# Altium project HAB-Main-Flight-Computer-Card-Template.PrjPcb (part 4 of 4)

## Sheet Power-Supplies.SchDoc: Main Flight Computer Power Supplies
size A2; Revision: 1A; SheetNumber: 7; SheetTotal: 7; Organization: Brickworks; Address1: Matthew Glazer; Address2: Design Engineer
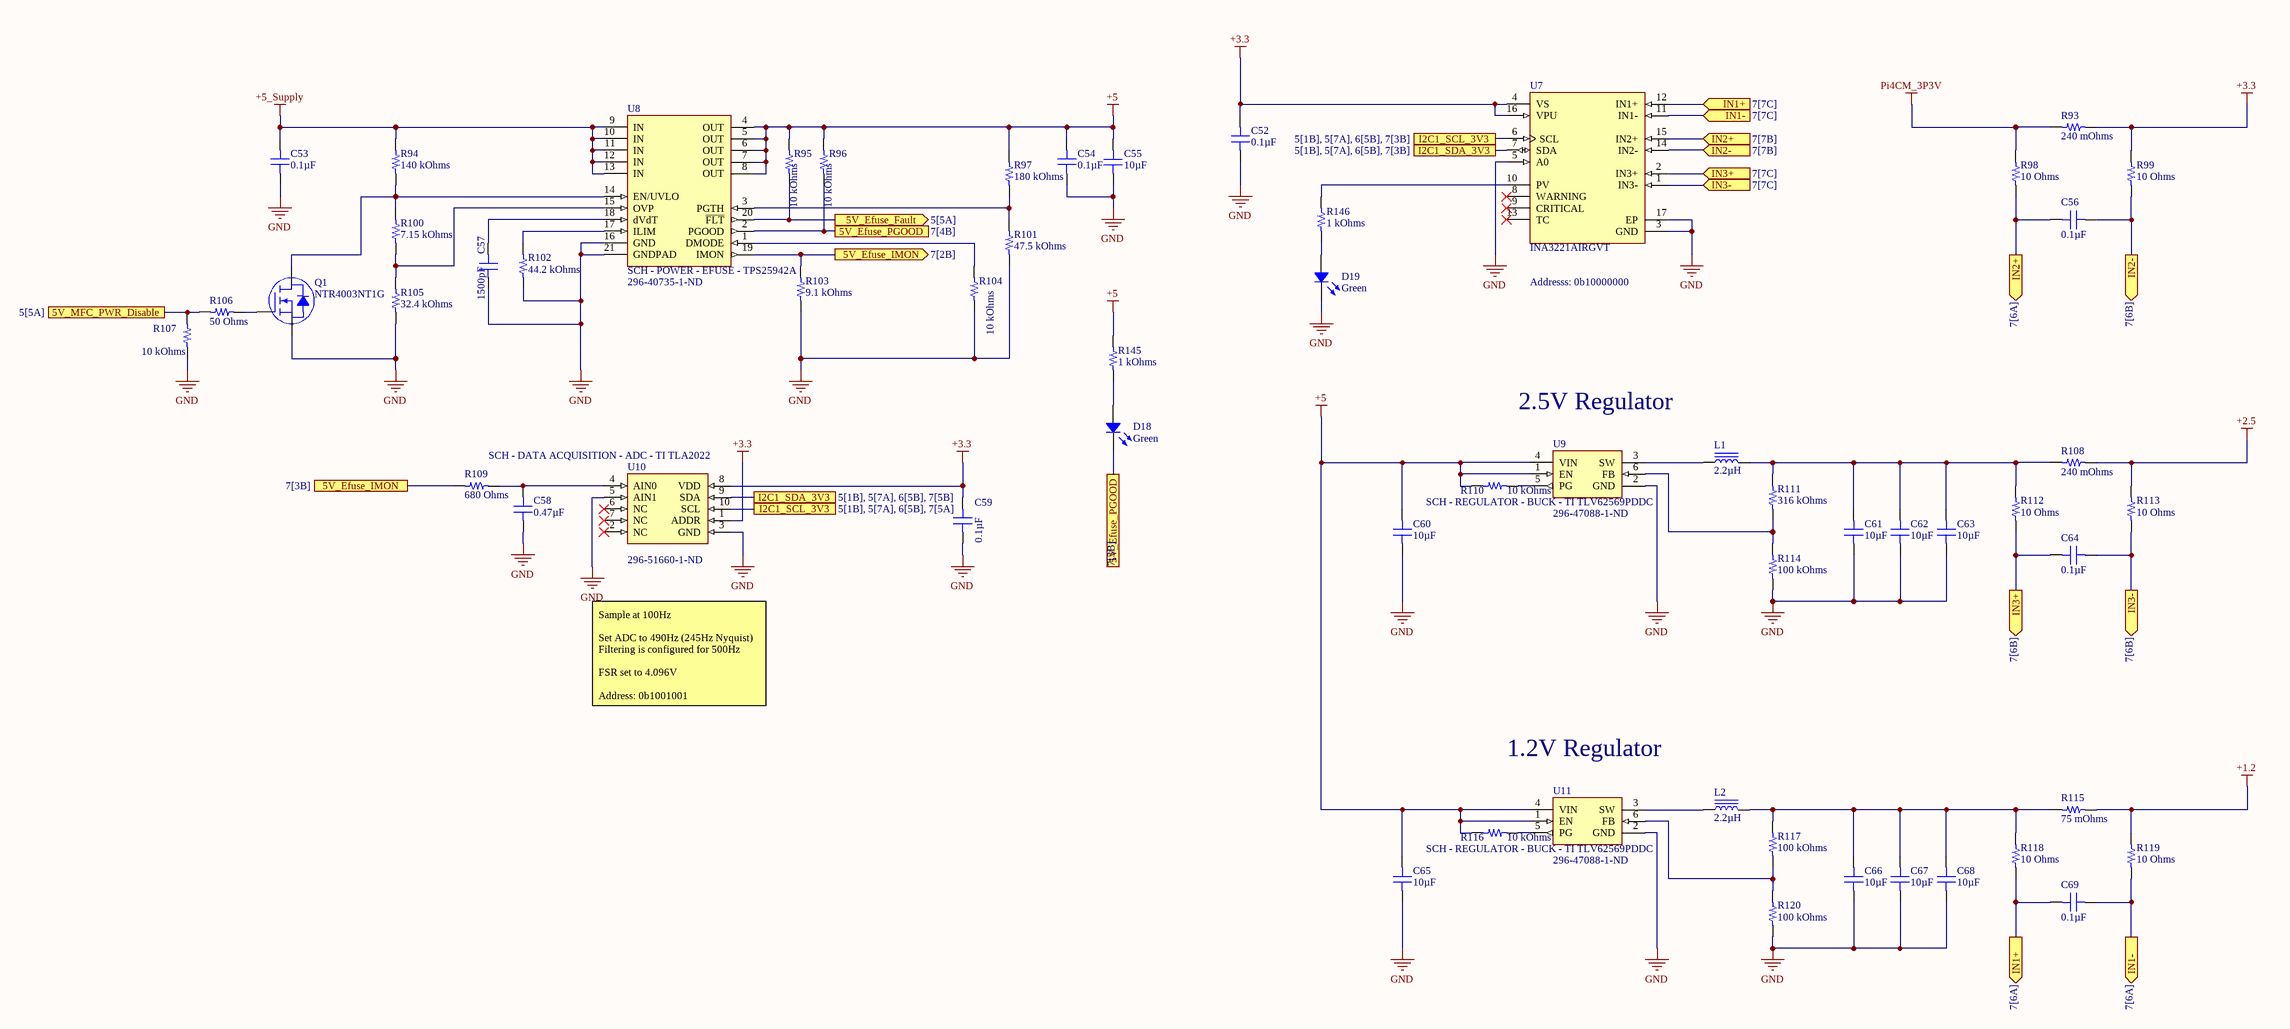
[diagram p8: Power-Supplies.SchDoc]

### Parts
C52  0.1µF  [CAP 0603_1608]
C53  0.1µF  [CAP 0603_1608]
C54  0.1µF  [CAP 0603_1608]
C55  10µF  [CAP 0805_2012]
C56  0.1µF  [CAP 0603_1608]
C57  1500pF  [CAP 0603_1608]
C58  0.47µF  [CAP 0603_1608]
C59  0.1µF  [CAP 0603_1608]
C60  10µF  [CAP 0805_2012]
C61  10µF  [CAP 0805_2012]
C62  10µF  [CAP 0805_2012]
C63  10µF  [CAP 0805_2012]
C64  0.1µF  [CAP 0603_1608]
C65  10µF  [CAP 0805_2012]
C66  10µF  [CAP 0805_2012]
C67  10µF  [CAP 0805_2012]
C68  10µF  [CAP 0805_2012]
C69  0.1µF  [CAP 0603_1608]
D18  Green  [LED 0603_1608 GREEN]
D19  Green  [LED 0603_1608 GREEN]
L1  2.2µH  [BOURNS SRN4018]
L2  2.2µH  [BOURNS SRN4018]
Q1  NTR4003NT1G  [ON SEMI SOT-23-3]
R93  240 mOhms  [RES 0805_2012]
R94  140 kOhms  [RES 0603_1608]
R95  10 kOhms  [RES 0603_1608]
R96  10 kOhms  [RES 0603_1608]
R97  180 kOhms  [RES 0603_1608]
R98  10 Ohms  [RES 0603_1608]
R99  10 Ohms  [RES 0603_1608]
R100  7.15 kOhms  [RES 0603_1608]
R101  47.5 kOhms  [RES 0603_1608]
R102  44.2 kOhms  [RES 0603_1608]
R103  9.1 kOhms  [RES 0603_1608]
R104  10 kOhms  [RES 0603_1608]
R105  32.4 kOhms  [RES 0603_1608]
R106  50 Ohms  [RES 0603_1608]
R107  10 kOhms  [RES 0603_1608]
R108  240 mOhms  [RES 0805_2012]
R109  680 Ohms  [RES 0603_1608]
R110  10 kOhms  [RES 0603_1608]
R111  316 kOhms  [RES 0603_1608]
R112  10 Ohms  [RES 0603_1608]
R113  10 Ohms  [RES 0603_1608]
R114  100 kOhms  [RES 0603_1608]
R115  75 mOhms  [RES 0805_2012]
R116  10 kOhms  [RES 0603_1608]
R117  100 kOhms  [RES 0603_1608]
R118  10 Ohms  [RES 0603_1608]
R119  10 Ohms  [RES 0603_1608]
R120  100 kOhms  [RES 0603_1608]
R145  1 kOhms  [RES 0603_1608]
R146  1 kOhms  [RES 0603_1608]
U7  INA3221AIRGVT  [RGV0016A_V]
U8  SCH - POWER - EFUSE - TPS25942A  Supplier Part Number 1: 296-40735-1-ND  [PCB - LEADLESS - QFN - TI 20-WQFN]
U9  SCH - REGULATOR - BUCK - TI TLV62569PDDC  Supplier Part Number 1: 296-47088-1-ND  [PCB - LEADS - SOT- TI TSOT-23-6]
U10  SCH - DATA ACQUISITION - ADC - TI TLA2022  Supplier Part Number 1: 296-51660-1-ND  [PCB - LEADLESS - QFN - TI X2QFN-10]
U11  SCH - REGULATOR - BUCK - TI TLV62569PDDC  Supplier Part Number 1: 296-47088-1-ND  [PCB - LEADS - SOT- TI TSOT-23-6]

### Ports
5V_Efuse_Fault (out, see 5[5A]), 5V_Efuse_IMON (out, see 7[2B]), 5V_Efuse_IMON (see 7[3B]), 5V_Efuse_PGOOD (see 7[3B]), 5V_Efuse_PGOOD (see 7[4B]), 5V_MFC_PWR_Disable (see 5[5A]), I2C1_SCL_3V3 (see 5[1B], 5[7A], 6[5B], 7[3B]), I2C1_SCL_3V3 (see 5[1B], 5[7A], 6[5B], 7[5A]), I2C1_SDA_3V3 (see 5[1B], 5[7A], 6[5B], 7[3B]), I2C1_SDA_3V3 (see 5[1B], 5[7A], 6[5B], 7[5B]), IN1+ (in, see 7[7C]), IN1+ (out, see 7[6A]), IN1- (in, see 7[7C]), IN1- (out, see 7[6A]), IN2+ (in, see 7[7B]), IN2+ (out, see 7[6A]), IN2- (in, see 7[7B]), IN2- (out, see 7[6B]), IN3+ (in, see 7[7C]), IN3+ (out, see 7[6B]), IN3- (in, see 7[7C]), IN3- (out, see 7[6B])

### Nets
+1.2: R115.2 R119.2
+2.5: R108.2 R113.2
+3.3: C52.2 C59.2 R93.2 R99.2 U7.4(VS) U7.16(VPU) U10.1(ADDR) U10.8(VDD)
+5: C54.2 C55.2 C60.2 C65.2 R95.2 R96.2 R97.2 R110.2 R116.2 R145.1 U8.4(OUT) U8.5(OUT) U8.6(OUT) U8.7(OUT) U8.8(OUT) U9.1(EN) U9.4(VIN) U11.1(EN) U11.4(VIN)
+5_Supply: C53.2 R94.2 U8.9(IN) U8.10(IN) U8.11(IN) U8.12(IN) U8.13(IN)
GND: C52.1 C53.1 C54.1 C55.1 C57.1 C58.1 C59.1 C60.1 C61.1 C62.1 C63.1 C65.1 C66.1 C67.1 C68.1 D19.2 Q1.2(S) R101.1 R102.1 R103.1 R104.1 R105.1 R107.1 R114.1 R120.1 U7.3(GND) U7.5(A0) U7.17(EP) U8.16(GND) U8.21(GNDPAD) U9.2(GND) U10.3(GND) U10.5(AIN1) U11.2(GND)
Pi4CM_3P3V: R93.1 R98.2
NetC56_1: C56.1 R99.1 U7.14(IN2-) ; port IN2-
NetC56_2: C56.2 R98.1 U7.15(IN2+) ; port IN2+
NetC57_2: C57.2 U8.18(dVdT)
NetC58_2: C58.2 R109.2 U10.4(AIN0)
NetC61_2: C61.2 C62.2 C63.2 L1.2 R108.1 R111.2 R112.2
NetC64_1: C64.1 R113.1 U7.1(IN3-) ; port IN3-
NetC64_2: C64.2 R112.1 U7.2(IN3+) ; port IN3+
NetC66_2: C66.2 C67.2 C68.2 L2.2 R115.1 R117.2 R118.2
NetC69_1: C69.1 R119.1 U7.11(IN1-) ; port IN1-
NetC69_2: C69.2 R118.1 U7.12(IN1+) ; port IN1+
NetD18_1: D18.1 R145.2
NetD18_2: D18.2 R96.1 U8.2(PGOOD) ; port 5V_Efuse_PGOOD
NetD19_1: D19.1 R146.1
NetL1_1: L1.1 U9.3(SW)
NetL2_1: L2.1 U11.3(SW)
NetQ1_1: Q1.1(G) R106.1
NetQ1_3: Q1.3(D) R94.1 R100.2 U8.14(EN/UVLO)
NetR95_1: R95.1 U8.20(~{FLT}) ; port 5V_Efuse_Fault
NetR97_1: R97.1 R101.2 U8.3(PGTH)
NetR100_1: R100.1 R105.2 U8.15(OVP)
NetR102_2: R102.2 U8.17(ILIM)
NetR103_2: R103.2 R109.1 U8.19(IMON) ; port 5V_Efuse_IMON
NetR104_2: R104.2 U8.1(DMODE)
NetR106_2: R106.2 R107.2 ; port 5V_MFC_PWR_Disable
NetR110_1: R110.1 U9.5(PG)
NetR111_1: R111.1 R114.2 U9.6(FB)
NetR116_1: R116.1 U11.5(PG)
NetR117_1: R117.1 R120.2 U11.6(FB)
NetR121_1: U7.7(SDA) U10.9(SDA) ; port I2C1_SDA_3V3
NetR122_1: U7.6(SCL) U10.10(SCL) ; port I2C1_SCL_3V3
NetR146_2: R146.2 U7.10(PV)

Not connected (* = marked no-connect by the designer): U7 8(WARNING)* 9(CRITICAL)* 13(TC)*; U10 2(NC)* 6(NC)* 7(NC)*

### Notes on the sheet
- Addresss: 0b10000000
- 2.5V Regulator
- Sample at 100Hz
  Set ADC to 490Hz (245Hz Nyquist)
  Filtering is configured for 500Hz
  FSR set to 4.096V
  Address: 0b1001001
- 1.2V Regulator
- Title
- Size:
- Date:
- File:
- A2
- Number:
- Time:
- Revision:
- Sheet
- of

### Library data of the parts
C52-C54 C56 C59 C64 C69 = CL10B104KA8WPNC: CAP CER 0.1UF 25V X7R 0603; Manufacturer: Samsung Electro-Mechanics; Tolerance: ±10%; Part Number: CL10B104KA8WPNC; Value: 0.1µF; Applications: Automotive; Capacitance: 0.1µF; ComponentLink1Description: Datasheet; ComponentLink1URL: http://www.samsungsem.com/kr/support/product-search/mlcc/CL10B104KA8WPNC.jsp; ComponentLink2Description: DigiKey Link; ComponentLink2URL: http://digikey.com/product-detail/en/samsung-electro-mechanics/CL10B104KA8WPNC/1276-6717-1-ND/5961576; Device Package: 0603 (1608 Metric); Features: Open Mode; LastUpdated: 9/2/2020 1:03:30 AM; Lifecycle Status: Active; Minimum Order: 1; Mounting Type: Surface Mount, MLCC; Operating Temperature: -55°C ~ 125°C; Package / Case: 0603 (1608 Metric); Packaging: TapeAndReel; PartId: 5631; Part Status: Active; Price: 0.02; Ratings: AEC-Q200; Series: CL; Size / Dimension: 0.063" L x 0.031" W (1.60mm x 0.80mm); Supplier 1: DigiKey; Supplier Part Number 1: 1276-6717-1-ND; Temperature Coefficient: X7R; Thickness (Max): 0.035" (0.90mm); Voltage - Rated: 25V
C55 C60-C63 C65-C68 = CC0805KKX5R7BB106: CAP CER 10UF 16V X5R 0805; Manufacturer: Yageo; Tolerance: ±10%; Part Number: CC0805KKX5R7BB106; Value: 10µF; Applications: General Purpose; Capacitance: 10µF; ComponentLink1Description: Datasheet; ComponentLink1URL: https://www.yageo.com/upload/media/product/productsearch/datasheet/mlcc/UPY-GPHC_X5R_4V-to-50V_25.pdf; ComponentLink2Description: DigiKey Link; ComponentLink2URL: http://digikey.com/product-detail/en/yageo/CC0805KKX5R7BB106/311-1865-1-ND/5195767; Device Package: 0805 (2012 Metric); LastUpdated: 9/2/2020 1:04:30 AM; Lifecycle Status: Active; Minimum Order: 1; Mounting Type: Surface Mount, MLCC; Operating Temperature: -55°C ~ 85°C; Package / Case: 0805 (2012 Metric); Packaging: TapeAndReel; PartId: 8867; Part Status: Active; Price: 0.09; Series: CC; Size / Dimension: 0.079" L x 0.049" W (2.00mm x 1.25mm); Supplier 1: DigiKey; Supplier Part Number 1: 311-1865-1-ND; Temperature Coefficient: X5R; Thickness (Max): 0.057" (1.45mm); Voltage - Rated: 16V
C57 = CC0603JRX7R8BB152: CAP CER 1500PF 25V X7R 0603; Manufacturer: Yageo; Tolerance: ±5%; Part Number: CC0603JRX7R8BB152; Value: 1500pF; Applications: General Purpose; Capacitance: 1500pF; ComponentLink1Description: Datasheet; ComponentLink1URL: https://www.yageo.com/upload/media/product/productsearch/datasheet/mlcc/UPY-GPHC_X7R_6.3V-to-50V_18.pdf; ComponentLink2Description: DigiKey Link; ComponentLink2URL: http://digikey.com/product-detail/en/yageo/CC0603JRX7R8BB152/311-3996-1-ND/8025085; Device Package: 0603 (1608 Metric); LastUpdated: 9/2/2020 1:03:18 AM; Lifecycle Status: Active; Minimum Order: 1; Mounting Type: Surface Mount, MLCC; Operating Temperature: -55°C ~ 125°C; Package / Case: 0603 (1608 Metric); Packaging: TapeAndReel; PartId: 12307; Part Status: Active; Price: 0.02; Series: CC; Size / Dimension: 0.063" L x 0.031" W (1.60mm x 0.80mm); Supplier 1: DigiKey; Supplier Part Number 1: 311-3996-1-ND; Temperature Coefficient: X7R; Thickness (Max): 0.035" (0.90mm); Voltage - Rated: 25V
C58 = C0603C474K4PACTU: CAP CER 0.47UF 16V X5R 0603; Manufacturer: KEMET; Tolerance: ±10%; Part Number: C0603C474K4PACTU; Value: 0.47µF; Applications: General Purpose; Capacitance: 0.47µF; ComponentLink1Description: Datasheet; ComponentLink1URL: https://api.kemet.com/component-edge/download/datasheet/C0603C474K4PACTU.pdf; ComponentLink2Description: DigiKey Link; ComponentLink2URL: http://digikey.com/product-detail/en/kemet/C0603C474K4PACTU/399-7934-1-ND/3471657; Device Package: 0603 (1608 Metric); LastUpdated: 9/2/2020 1:03:36 AM; Lifecycle Status: Active; Minimum Order: 1; Mounting Type: Surface Mount, MLCC; Operating Temperature: -55°C ~ 85°C; Package / Case: 0603 (1608 Metric); Packaging: TapeAndReel; PartId: 2292; Part Status: Active; Price: 0.02; Series: SMD Comm X5R; Size / Dimension: 0.063" L x 0.031" W (1.60mm x 0.80mm); Supplier 1: DigiKey; Supplier Part Number 1: 399-7934-1-ND; Temperature Coefficient: X5R; Thickness (Max): 0.034" (0.87mm); Voltage - Rated: 16V
D18 D19 = LTST-C193KGKT-5A: LED GREEN CLEAR CHIP SMD; Manufacturer: Lite-On Inc.; Configuration: Standard; Current - Test: 5mA; Lens Color: Colorless; Lens Size: 1.15mm x 0.80mm; Lens Style: Rectangle with Flat Top; Millicandela Rating: 16.25mcd; Viewing Angle: 130°; Voltage - Forward (Vf) (Typ): 2V; Wavelength - Dominant: 572nm; Wavelength - Peak: 574nm; Part Number: LTST-C193KGKT-5A; Color: Green; ComponentLink1Description: Datasheet; ComponentLink1URL: http://optoelectronics.liteon.com/upload/download/DS22-2007-0094/LTST-C193KGKT-5A.PDF; ComponentLink2Description: DigiKey Link; ComponentLink2URL: http://digikey.com/product-detail/en/lite-on-inc/LTST-C193KGKT-5A/160-1828-1-ND/2356247; Device Package: 0603 (1608 Metric); Height (Max): 0.45mm; LastUpdated: 9/2/2020 1:20:41 AM; Lens Transparency: Clear; Lifecycle Status: Active; Minimum Order: 1; Mounting Type: Surface Mount; Package / Case: 0603 (1608 Metric); Packaging: TapeAndReel; PartId: 694; Part Status: Active; Price: 0.06; Series: -; Size / Dimension: 1.60mm L x 0.80mm W; Supplier 1: DigiKey; Supplier Part Number 1: 160-1828-1-ND; Supplier Device Package: Chip LED; Value: Green
L1 L2 = SRN4018-2R2M: FIXED IND 2.2UH 2.9A 44 MOHM SMD; Manufacturer: Bourns Inc.; Current - Saturation: 3A; DC Resistance (DCR): 44mOhm Max; Frequency - Self Resonant: 60MHz; Inductance Frequency - Test: 100kHz; Material - Core: Ferrite; Q @ Freq: 9 @ 7.96MHz; Shielding: Semi-Shielded; Tolerance: ±20%; Type: Wirewound; Part Number: SRN4018-2R2M; ComponentLink1Description: Datasheet; ComponentLink1URL: https://www.bourns.com/docs/Product-Datasheets/SRN4018.pdf; ComponentLink2Description: DigiKey Link; ComponentLink2URL: http://digikey.com/product-detail/en/bourns-inc/SRN4018-2R2M/SRN4018-2R2MCT-ND/3821517; Current Rating (Amps): 2.9A; Device Package: Nonstandard; Height - Seated (Max): 0.071" (1.80mm); Inductance: 2.2µH; LastUpdated: 9/2/2020 1:30:23 AM; Lifecycle Status: Active; Minimum Order: 1; Mounting Type: Surface Mount; Operating Temperature: -40°C ~ 125°C; Package / Case: Nonstandard; Packaging: TapeAndReel; PartId: 3660; Part Status: Active; Price: 0.16; Series: SRN4018; Size / Dimension: 0.157" L x 0.157" W (4.00mm x 4.00mm); Supplier 1: DigiKey; Supplier Part Number 1: SRN4018-2R2MCT-ND; Value: 2.2µH
Q1 = NTR4003NT1G: MOSFET N-CH 30V 500MA SOT-23; Manufacturer: ON Semiconductor; Current - Continuous Drain (Id) @ 25°C: 500mA (Ta); Drive Voltage (Max Rds On,  Min Rds On): 2.5V, 4V; FET Type: N-Channel; Gate Charge (Qg) (Max) @ Vgs: 1.15nC @ 5V; Input Capacitance (Ciss) (Max) @ Vds: 21pF @ 5V; Power Dissipation (Max): 690mW (Ta); Rds On (Max) @ Id, Vgs: 1.5Ohm @ 10mA, 4V; Vgs (Max): ±20V; Vgs(th) (Max) @ Id: 1.4V @ 250µA; Part Number: NTR4003NT1G; ComponentLink1Description: Datasheet; ComponentLink1URL: http://www.onsemi.com/pub/Collateral/NTR4003N-D.PDF; ComponentLink2Description: DigiKey Link; ComponentLink2URL: http://digikey.com/product-detail/en/on-semiconductor/NTR4003NT1G/NTR4003NT1GOSCT-ND/1967270; Drain to Source Voltage (Vdss): 30V; LastUpdated: 9/2/2020 1:25:08 AM; Lifecycle Status: Active; Minimum Order: 1; Mounting Type: Surface Mount; Operating Temperature: -55°C ~ 150°C (TJ); Package / Case: TO-236-3, SC-59, SOT-23-3; Packaging: TapeAndReel; Part Status: Active; Price: 0.05; Series: -; Supplier 1: DigiKey; Supplier Part Number 1: NTR4003NT1GOSCT-ND; Supplier Device Package: SOT-23-3 (TO-236); Technology: MOSFET (Metal Oxide)
R93 R108 = KDV08FR240ET: RES 240M OHM 1% 1/4W 0805; Manufacturer: Ohmite; Power (Watts): 0.25W, 1/4W; Temperature Coefficient: ±50ppm/°C; Part Number: KDV08FR240ET; Value: 240 mOhms; ComponentLink1Description: Datasheet; ComponentLink1URL: https://www.ohmite.com/assets/docs/res_kdv.pdf?r=false; ComponentLink2Description: DigiKey Link; ComponentLink2URL: http://digikey.com/product-detail/en/ohmite/KDV08FR240ET/273-KDV08FR240ETCT-ND/10476983; Composition: Metal Film; Device Package: 0805 (2012 Metric); Features: Current Sense; Height - Seated (Max): 0.026" (0.65mm); LastUpdated: 9/2/2020 1:14:23 AM; Lifecycle Status: Active; Minimum Order: 1; Number of Terminations: 2; Operating Temperature: -55°C ~ 155°C; Package / Case: 0805 (2012 Metric); Packaging: TapeAndReel; PartId: 49831; Part Status: Active; Price: 0.03; Resistance: 240 mOhms; Series: KDV; Size / Dimension: 0.079" L x 0.049" W (2.00mm x 1.25mm); Supplier 1: DigiKey; Supplier Part Number 1: 273-KDV08FR240ETCT-ND; Supplier Device Package: 0805; Tolerance: ±1%
R94 = RT0603BRE07140KL: RES SMD 140K OHM 0.1% 1/10W 0603; Manufacturer: Yageo; Power (Watts): 0.1W, 1/10W; Temperature Coefficient: ±50ppm/°C; Part Number: RT0603BRE07140KL; Value: 140 kOhms; ComponentLink1Description: Datasheet; ComponentLink1URL: https://www.yageo.com/upload/media/product/productsearch/datasheet/rchip/PYu-RT_1-to-0.01_RoHS_L_11.pdf; ComponentLink2Description: DigiKey Link; ComponentLink2URL: http://digikey.com/product-detail/en/yageo/RT0603BRE07140KL/YAG4626CT-ND/6616782; Composition: Thin Film; Device Package: 0603 (1608 Metric); Height - Seated (Max): 0.022" (0.55mm); LastUpdated: 9/2/2020 1:09:47 AM; Lifecycle Status: Active; Minimum Order: 1; Number of Terminations: 2; Operating Temperature: -55°C ~ 155°C; Package / Case: 0603 (1608 Metric); Packaging: TapeAndReel; PartId: 22168; Part Status: Active; Price: 0.05; Resistance: 140 kOhms; Series: RT; Size / Dimension: 0.063" L x 0.031" W (1.60mm x 0.80mm); Supplier 1: DigiKey; Supplier Part Number 1: YAG4626CT-ND; Supplier Device Package: 0603; Tolerance: ±0.1%
R95 R96 R104 R107 R110 R116 = RMCF0603JT10K0: RES 10K OHM 5% 1/10W 0603; Manufacturer: Stackpole Electronics Inc; Power (Watts): 0.1W, 1/10W; Temperature Coefficient: ±200ppm/°C; Part Number: RMCF0603JT10K0; Value: 10 kOhms; ComponentLink1Description: Datasheet; ComponentLink1URL: https://www.seielect.com/catalog/sei-packaging.pdf; ComponentLink2Description: DigiKey Link; ComponentLink2URL: http://digikey.com/product-detail/en/stackpole-electronics-inc/RMCF0603JT10K0/RMCF0603JT10K0CT-ND/1943191; Composition: Thick Film; Device Package: 0603 (1608 Metric); Features: Automotive AEC-Q200; Height - Seated (Max): 0.022" (0.55mm); LastUpdated: 9/2/2020 1:09:31 AM; Lifecycle Status: Active; Minimum Order: 1; Number of Terminations: 2; Operating Temperature: -55°C ~ 155°C; Package / Case: 0603 (1608 Metric); Packaging: CutTape; PartId: 25659; Part Status: Active; Price: 0.10; Ratings: AEC-Q200; Resistance: 10 kOhms; Series: RMCF; Size / Dimension: 0.061" L x 0.031" W (1.55mm x 0.80mm); Supplier 1: DigiKey; Supplier Part Number 1: RMCF0603JT10K0CT-ND; Supplier Device Package: 0603; Tolerance: ±5%
R97 = RMCF0603FT180K: RES 180K OHM 1% 1/10W 0603; Manufacturer: Stackpole Electronics Inc; Power (Watts): 0.1W, 1/10W; Temperature Coefficient: ±100ppm/°C; Part Number: RMCF0603FT180K; Value: 180 kOhms; ComponentLink1Description: Datasheet; ComponentLink1URL: https://www.seielect.com/catalog/sei-rmcf_rmcp.pdf; ComponentLink2Description: DigiKey Link; ComponentLink2URL: http://digikey.com/product-detail/en/stackpole-electronics-inc/RMCF0603FT180K/RMCF0603FT180KCT-ND/5049744; Composition: Thick Film; Device Package: 0603 (1608 Metric); Features: Automotive AEC-Q200; Height - Seated (Max): 0.022" (0.55mm); LastUpdated: 9/2/2020 1:10:00 AM; Lifecycle Status: Active; Minimum Order: 1; Number of Terminations: 2; Operating Temperature: -55°C ~ 155°C; Package / Case: 0603 (1608 Metric); Packaging: CutTape; PartId: 16499; Part Status: Active; Price: 0.10; Ratings: AEC-Q200; Resistance: 180 kOhms; Series: RMCF; Size / Dimension: 0.061" L x 0.031" W (1.55mm x 0.80mm); Supplier 1: DigiKey; Supplier Part Number 1: RMCF0603FT180KCT-ND; Supplier Device Package: 0603; Tolerance: ±1%
R98 R99 R112 R113 R118 R119 = CRGCQ0603F10R: CRGCQ 0603 10R 1%; Manufacturer: TE Connectivity Passive Product; Power (Watts): 0.1W, 1/10W; Temperature Coefficient: ±400ppm/°C; Part Number: CRGCQ0603F10R; Value: 10 Ohms; ComponentLink1Description: Datasheet; ComponentLink1URL: https://www.te.com/commerce/DocumentDelivery/DDEController?Action=srchrtrv&DocNm=1773204-3&DocType=DS&DocLang=English; ComponentLink2Description: DigiKey Link; ComponentLink2URL: http://digikey.com/product-detail/en/te-connectivity-passive-product/CRGCQ0603F10R/A129664CT-ND/8577496; Composition: Thick Film; Device Package: 0603 (1608 Metric); Features: Automotive AEC-Q200, Moisture Resistant; Height - Seated (Max): 0.022" (0.55mm); LastUpdated: 9/2/2020 1:09:39 AM; Lifecycle Status: Active; Minimum Order: 1; Number of Terminations: 2; Operating Temperature: -55°C ~ 155°C; Package / Case: 0603 (1608 Metric); Packaging: CutTape; PartId: 23975; Part Status: Active; Price: 0.10; Ratings: AEC-Q200; Resistance: 10 Ohms; Series: CRGCQ; Size / Dimension: 0.063" L x 0.031" W (1.60mm x 0.80mm); Supplier 1: DigiKey; Supplier Part Number 1: A129664CT-ND; Supplier Device Package: 0603; Tolerance: ±1%
R100 = ERJ-PB3B7151V: RES SMD 7.15K OHM 0.1% 1/5W 0603; Manufacturer: Panasonic Electronic Components; Power (Watts): 0.2W, 1/5W; Temperature Coefficient: ±50ppm/°C; Part Number: ERJ-PB3B7151V; Value: 7.15 kOhms; ComponentLink1Description: Datasheet; ComponentLink1URL: https://industrial.panasonic.com/cdbs/www-data/pdf/RDM0000/AOA0000C328.pdf; ComponentLink2Description: DigiKey Link; ComponentLink2URL: http://digikey.com/product-detail/en/panasonic-electronic-components/ERJ-PB3B7151V/P20070CT-ND/6214325; Composition: Thick Film; Device Package: 0603 (1608 Metric); Features: Automotive AEC-Q200, Pulse Withstanding; Height - Seated (Max): 0.022" (0.55mm); LastUpdated: 9/2/2020 1:10:22 AM; Lifecycle Status: Active; Minimum Order: 1; Number of Terminations: 2; Operating Temperature: -55°C ~ 155°C; Package / Case: 0603 (1608 Metric); Packaging: TapeAndReel; PartId: 6380; Part Status: Active; Price: 0.03; Ratings: AEC-Q200; Resistance: 7.15 kOhms; Series: ERJ; Size / Dimension: 0.063" L x 0.031" W (1.60mm x 0.80mm); Supplier 1: DigiKey; Supplier Part Number 1: P20070CT-ND; Supplier Device Package: 0603; Tolerance: ±0.1%
R101 = RMCF0603FG47K5: RES 47.5K OHM 1% 1/10W 0603; Manufacturer: Stackpole Electronics Inc; Power (Watts): 0.1W, 1/10W; Temperature Coefficient: ±100ppm/°C; Part Number: RMCF0603FG47K5; Value: 47.5 kOhms; ComponentLink1Description: Datasheet; ComponentLink1URL: https://www.seielect.com/catalog/sei-packaging.pdf; ComponentLink2Description: DigiKey Link; ComponentLink2URL: http://digikey.com/product-detail/en/stackpole-electronics-inc/RMCF0603FG47K5/RMCF0603FG47K5CT-ND/4425046; Composition: Thick Film; Device Package: 0603 (1608 Metric); Features: Automotive AEC-Q200; Height - Seated (Max): 0.022" (0.55mm); LastUpdated: 9/2/2020 1:09:32 AM; Lifecycle Status: Active; Minimum Order: 1; Number of Terminations: 2; Operating Temperature: -55°C ~ 155°C; Package / Case: 0603 (1608 Metric); Packaging: CutTape; PartId: 25458; Part Status: Active; Price: 0.10; Ratings: AEC-Q200; Resistance: 47.5 kOhms; Series: RMCF; Size / Dimension: 0.061" L x 0.031" W (1.55mm x 0.80mm); Supplier 1: DigiKey; Supplier Part Number 1: RMCF0603FG47K5CT-ND; Supplier Device Package: 0603; Tolerance: ±1%
R102 = RMCF0603FT44K2: RES 44.2K OHM 1% 1/10W 0603; Manufacturer: Stackpole Electronics Inc; Power (Watts): 0.1W, 1/10W; Temperature Coefficient: ±100ppm/°C; Part Number: RMCF0603FT44K2; Value: 44.2 kOhms; ComponentLink1Description: Datasheet; ComponentLink1URL: https://www.seielect.com/catalog/sei-rmcf_rmcp.pdf; ComponentLink2Description: DigiKey Link; ComponentLink2URL: http://digikey.com/product-detail/en/stackpole-electronics-inc/RMCF0603FT44K2/RMCF0603FT44K2CT-ND/2418066; Composition: Thick Film; Device Package: 0603 (1608 Metric); Features: Automotive AEC-Q200; Height - Seated (Max): 0.022" (0.55mm); LastUpdated: 9/2/2020 1:10:13 AM; Lifecycle Status: Active; Minimum Order: 1; Number of Terminations: 2; Operating Temperature: -55°C ~ 155°C; Package / Case: 0603 (1608 Metric); Packaging: CutTape; PartId: 10823; Part Status: Active; Price: 0.10; Resistance: 44.2 kOhms; Series: RMCF; Size / Dimension: 0.061" L x 0.031" W (1.55mm x 0.80mm); Supplier 1: DigiKey; Supplier Part Number 1: RMCF0603FT44K2CT-ND; Supplier Device Package: 0603; Tolerance: ±1%; Ratings: AEC-Q200
R103 = RMCF0603FT9K10: RES 9.1K OHM 1% 1/10W 0603; Manufacturer: Stackpole Electronics Inc; Power (Watts): 0.1W, 1/10W; Temperature Coefficient: ±100ppm/°C; Part Number: RMCF0603FT9K10; Value: 9.1 kOhms; ComponentLink1Description: Datasheet; ComponentLink1URL: https://www.seielect.com/catalog/sei-rmcf_rmcp.pdf; ComponentLink2Description: DigiKey Link; ComponentLink2URL: http://digikey.com/product-detail/en/stackpole-electronics-inc/RMCF0603FT9K10/RMCF0603FT9K10CT-ND/6052977; Composition: Thick Film; Device Package: 0603 (1608 Metric); Features: Automotive AEC-Q200; Height - Seated (Max): 0.022" (0.55mm); LastUpdated: 9/2/2020 1:10:11 AM; Lifecycle Status: Active; Minimum Order: 1; Number of Terminations: 2; Operating Temperature: -55°C ~ 155°C; Package / Case: 0603 (1608 Metric); Packaging: CutTape; PartId: 11761; Part Status: Active; Price: 0.10; Ratings: AEC-Q200; Resistance: 9.1 kOhms; Series: RMCF; Size / Dimension: 0.061" L x 0.031" W (1.55mm x 0.80mm); Supplier 1: DigiKey; Supplier Part Number 1: RMCF0603FT9K10CT-ND; Supplier Device Package: 0603; Tolerance: ±1%
R105 = ERJ-PB3B3242V: RES SMD 32.4K OHM 0.1% 1/5W 0603; Manufacturer: Panasonic Electronic Components; Power (Watts): 0.2W, 1/5W; Temperature Coefficient: ±50ppm/°C; Part Number: ERJ-PB3B3242V; Value: 32.4 kOhms; ComponentLink1Description: Datasheet; ComponentLink1URL: https://industrial.panasonic.com/cdbs/www-data/pdf/RDM0000/AOA0000C328.pdf; ComponentLink2Description: DigiKey Link; ComponentLink2URL: http://digikey.com/product-detail/en/panasonic-electronic-components/ERJ-PB3B3242V/P20142CT-ND/6214397; Composition: Thick Film; Device Package: 0603 (1608 Metric); Features: Automotive AEC-Q200, Pulse Withstanding; Height - Seated (Max): 0.022" (0.55mm); LastUpdated: 9/2/2020 1:10:06 AM; Lifecycle Status: Active; Minimum Order: 1; Number of Terminations: 2; Operating Temperature: -55°C ~ 155°C; Package / Case: 0603 (1608 Metric); Packaging: TapeAndReel; PartId: 13586; Part Status: Active; Price: 0.03; Ratings: AEC-Q200; Resistance: 32.4 kOhms; Series: ERJ; Size / Dimension: 0.063" L x 0.031" W (1.60mm x 0.80mm); Supplier 1: DigiKey; Supplier Part Number 1: P20142CT-ND; Supplier Device Package: 0603; Tolerance: ±0.1%
R106 = CRCW060350R0FKEA: RES SMD 50 OHM 1% 1/10W 0603; Manufacturer: Vishay Dale; Power (Watts): 0.1W, 1/10W; Temperature Coefficient: ±100ppm/°C; Part Number: CRCW060350R0FKEA; Value: 50 Ohms; ComponentLink1Description: Datasheet; ComponentLink1URL: http://www.vishay.com/docs/20035/dcrcwe3.pdf; ComponentLink2Description: DigiKey Link; ComponentLink2URL: http://digikey.com/product-detail/en/vishay-dale/CRCW060350R0FKEA/541-3318-1-ND/6684924; Composition: Thick Film; Device Package: 0603 (1608 Metric); Features: Automotive AEC-Q200; Height - Seated (Max): 0.020" (0.50mm); LastUpdated: 9/2/2020 1:09:40 AM; Lifecycle Status: Active; Minimum Order: 1; Number of Terminations: 2; Operating Temperature: -55°C ~ 155°C; Package / Case: 0603 (1608 Metric); Packaging: CutTape; PartId: 23780; Part Status: Active; Price: 0.10; Ratings: AEC-Q200; Resistance: 50 Ohms; Series: CRCW; Size / Dimension: 0.061" L x 0.033" W (1.55mm x 0.85mm); Supplier 1: DigiKey; Supplier Part Number 1: 541-3318-1-ND; Supplier Device Package: 0603; Tolerance: ±1%
R109 = RMCF0603FT680R: RES 680 OHM 1% 1/10W 0603; Manufacturer: Stackpole Electronics Inc; Power (Watts): 0.1W, 1/10W; Temperature Coefficient: ±100ppm/°C; Part Number: RMCF0603FT680R; Value: 680 Ohms; ComponentLink1Description: Datasheet; ComponentLink1URL: https://www.seielect.com/catalog/sei-packaging.pdf; ComponentLink2Description: DigiKey Link; ComponentLink2URL: http://digikey.com/product-detail/en/stackpole-electronics-inc/RMCF0603FT680R/RMCF0603FT680RCT-ND/6053170; Composition: Thick Film; Device Package: 0603 (1608 Metric); Features: Automotive AEC-Q200; Height - Seated (Max): 0.022" (0.55mm); LastUpdated: 9/2/2020 1:10:13 AM; Lifecycle Status: Active; Minimum Order: 1; Number of Terminations: 2; Operating Temperature: -55°C ~ 155°C; Package / Case: 0603 (1608 Metric); Packaging: CutTape; PartId: 10671; Part Status: Active; Price: 0.10; Ratings: AEC-Q200; Resistance: 680 Ohms; Series: RMCF; Size / Dimension: 0.061" L x 0.031" W (1.55mm x 0.80mm); Supplier 1: DigiKey; Supplier Part Number 1: RMCF0603FT680RCT-ND; Supplier Device Package: 0603; Tolerance: ±1%
R111 = RMCF0603FT316K: RES 316K OHM 1% 1/10W 0603; Manufacturer: Stackpole Electronics Inc; Power (Watts): 0.1W, 1/10W; Temperature Coefficient: ±100ppm/°C; Part Number: RMCF0603FT316K; Value: 316 kOhms; ComponentLink1Description: Datasheet; ComponentLink1URL: https://www.seielect.com/catalog/sei-rmcf_rmcp.pdf; ComponentLink2Description: DigiKey Link; ComponentLink2URL: http://digikey.com/product-detail/en/stackpole-electronics-inc/RMCF0603FT316K/RMCF0603FT316KCT-ND/2418023; Composition: Thick Film; Device Package: 0603 (1608 Metric); Features: Automotive AEC-Q200; Height - Seated (Max): 0.022" (0.55mm); LastUpdated: 9/2/2020 1:09:52 AM; Lifecycle Status: Active; Minimum Order: 1; Number of Terminations: 2; Operating Temperature: -55°C ~ 155°C; Package / Case: 0603 (1608 Metric); Packaging: CutTape; PartId: 19849; Part Status: Active; Price: 0.10; Ratings: AEC-Q200; Resistance: 316 kOhms; Series: RMCF; Size / Dimension: 0.061" L x 0.031" W (1.55mm x 0.80mm); Supplier 1: DigiKey; Supplier Part Number 1: RMCF0603FT316KCT-ND; Supplier Device Package: 0603; Tolerance: ±1%
R114 R117 R120 = RMCF0603FT100K: RES 100K OHM 1% 1/10W 0603; Manufacturer: Stackpole Electronics Inc; Power (Watts): 0.1W, 1/10W; Temperature Coefficient: ±100ppm/°C; Part Number: RMCF0603FT100K; Value: 100 kOhms; ComponentLink1Description: Datasheet; ComponentLink1URL: https://www.seielect.com/catalog/sei-packaging.pdf; ComponentLink2Description: DigiKey Link; ComponentLink2URL: http://digikey.com/product-detail/en/stackpole-electronics-inc/RMCF0603FT100K/RMCF0603FT100KCT-ND/1943118; Composition: Thick Film; Device Package: 0603 (1608 Metric); Features: Automotive AEC-Q200; Height - Seated (Max): 0.022" (0.55mm); LastUpdated: 9/2/2020 1:09:31 AM; Lifecycle Status: Active; Minimum Order: 1; Number of Terminations: 2; Operating Temperature: -55°C ~ 155°C; Package / Case: 0603 (1608 Metric); Packaging: CutTape; PartId: 25664; Part Status: Active; Price: 0.10; Ratings: AEC-Q200; Resistance: 100 kOhms; Series: RMCF; Size / Dimension: 0.061" L x 0.031" W (1.55mm x 0.80mm); Supplier 1: DigiKey; Supplier Part Number 1: RMCF0603FT100KCT-ND; Supplier Device Package: 0603; Tolerance: ±1%
R115 = ERJ-L06UF75MV: RES 0.075 OHM 1% 1/4W 0805; Manufacturer: Panasonic Electronic Components; Power (Watts): 0.25W, 1/4W; Temperature Coefficient: ±100ppm/°C; Part Number: ERJ-L06UF75MV; Value: 75 mOhms; ComponentLink1Description: Datasheet; ComponentLink1URL: https://industrial.panasonic.com/cdbs/www-data/pdf/RDN0000/AOA0000C313.pdf; ComponentLink2Description: DigiKey Link; ComponentLink2URL: http://digikey.com/product-detail/en/panasonic-electronic-components/ERJ-L06UF75MV/P75LLCT-ND/966124; Composition: Thick Film; Device Package: 0805 (2012 Metric); Features: Automotive AEC-Q200, Current Sense; Height - Seated (Max): 0.028" (0.70mm); LastUpdated: 9/2/2020 1:15:15 AM; Lifecycle Status: Active; Minimum Order: 1; Number of Terminations: 2; Operating Temperature: -55°C ~ 125°C; Package / Case: 0805 (2012 Metric); Packaging: TapeAndReel; PartId: 31851; Part Status: Active; Price: 0.09; Ratings: AEC-Q200; Resistance: 75 mOhms; Series: ERJ; Size / Dimension: 0.079" L x 0.049" W (2.00mm x 1.25mm); Supplier 1: DigiKey; Supplier Part Number 1: P75LLCT-ND; Supplier Device Package: 0805; Tolerance: ±1%
R145 R146 = RNCP0603FTD1K00: RES 1K OHM 1% 1/8W 0603; Manufacturer: Stackpole Electronics Inc; Power (Watts): 0.125W, 1/8W; Temperature Coefficient: ±100ppm/°C; Part Number: RNCP0603FTD1K00; Value: 1 kOhms; ComponentLink1Description: Datasheet; ComponentLink1URL: https://www.seielect.com/catalog/sei-rncp.pdf; ComponentLink2Description: DigiKey Link; ComponentLink2URL: http://digikey.com/product-detail/en/stackpole-electronics-inc/RNCP0603FTD1K00/RNCP0603FTD1K00CT-ND/2240445; Composition: Thin Film; Device Package: 0603 (1608 Metric); Features: Anti-Sulfur, Moisture Resistant; Height - Seated (Max): 0.020" (0.50mm); LastUpdated: 9/2/2020 1:10:23 AM; Lifecycle Status: Active; Minimum Order: 1; Number of Terminations: 2; Operating Temperature: -55°C ~ 155°C; Package / Case: 0603 (1608 Metric); Packaging: TapeAndReel; PartId: 5694; Part Status: Active; Price: 0.01; Resistance: 1 kOhms; Series: RNCP; Size / Dimension: 0.059" L x 0.031" W (1.50mm x 0.80mm); Supplier 1: DigiKey; Supplier Part Number 1: RNCP0603FTD1K00CT-ND; Supplier Device Package: 0603; Tolerance: ±1%
U7 = CMP-0704-00002-2: Triple Channel Shunt and Bus Voltage Monitor, 120 dB, 2.7 to 5.5 V, -40 to 125 degC, 16-Pin VQFN (RGV), Green (RoHS & no Sb/Br), Tape and Reel; Manufacturer: Texas Instruments; Voltage Input Range (Bus): 0 to 26 V; Gain Error (max): 0.25%; Gain: 1 V/V; CMR (Typ): 120 dB; Offset Voltage (max): +/- 80 uV; Rating: Catalog; Quiescent Current (Typ): 350 uA; Mounting Technology: Surface Mount; PackageReference: RGV0016A; PackageDescription: 16-Pin Quad Flat No-lead Package, Body 4 x 4 mm, Pitch 0.65 mm; ComponentLink3Description: Package Specification; RoHS: TRUE; ComponentLink3URL: http://www.ti.com/lit/ds/symlink/ina3221.pdf; Packing: Tape and Reel; ComponentLink2URL: http://www.ti.com/lit/ds/symlink/ina3221.pdf; Operating Supply Range: 2.7 to 5.5 V; PackageVersion: SBOS576A; ComponentLink1Description: Manufacturer URL; DatasheetVersion: SBOS576A; ComponentLink1URL: http://www.ti.com/; Temperature Range: -40 to 125 degC; PartNumber: INA3221AIRGVT; ComponentLink2Description: Datasheet
U8 = SCH - POWER - EFUSE - TPS25942A: Supplier 1: Digi-Key
U9 U11 = SCH - REGULATOR - BUCK - TI TLV62569PDDC: Supplier 1: Digi-Key
U10 = SCH - DATA ACQUISITION - ADC - TI TLA2022: Supplier 1: Digi-Key

## Nets that join several sheets
+1.2: NetworkSwitch (38 pins), EthernetBridge (15 pins), Power-Supplies (R115.2 R119.2)
+2.5: Interfaces (20 pins), NetworkSwitch (15 pins), EthernetBridge (8 pins), Power-Supplies (R108.2 R113.2)
+3.3: Interfaces (C11.2 U2.1), CANbus (C12.2 C16.2 U4.5 U5.18), NetworkSwitch (30 pins), EthernetBridge (27 pins), ComputeModule (11 pins), Sensors (5 pins), Power-Supplies (8 pins)
+5: CANbus (C13.2 U4.3), ComputeModule (10 pins), Power-Supplies (19 pins)
+5_Supply: Interfaces (C3.2 C4.2 J1.5 J1.6), Power-Supplies (7 pins)
GND: Interfaces (54 pins), CANbus (13 pins), NetworkSwitch (50 pins), EthernetBridge (35 pins), ComputeModule (58 pins), Sensors (9 pins), Power-Supplies (34 pins)
Pi4CM_3P3V: ComputeModule (U1.78 U1.84 U1.86), Power-Supplies (R93.1 R98.2)
ETH1_RX_N: Interfaces (J2.32), ComputeModule (U1.6)
ETH1_RX_P: Interfaces (J2.31), ComputeModule (U1.4)
ETH1_TX_N: Interfaces (J2.34), ComputeModule (U1.10)
ETH1_TX_P: Interfaces (J2.33), ComputeModule (U1.12)
ETH2_RX_N: Interfaces (J2.2 R23.1), NetworkSwitch (U6.38)
ETH2_RX_P: Interfaces (J2.1 R22.1), NetworkSwitch (U6.37)
ETH2_TX_N: Interfaces (J2.4 R25.1), NetworkSwitch (U6.35)
ETH2_TX_P: Interfaces (J2.3 R24.1), NetworkSwitch (U6.34)
ETH3_RX_N: Interfaces (J2.8 R27.1), NetworkSwitch (U6.27)
ETH3_RX_P: Interfaces (J2.7 R26.1), NetworkSwitch (U6.26)
ETH3_TX_N: Interfaces (J2.10 R29.1), NetworkSwitch (U6.25)
ETH3_TX_P: Interfaces (J2.9 R28.1), NetworkSwitch (U6.24)
ETH4_RX_N: Interfaces (J2.14 R31.1), NetworkSwitch (U6.16)
ETH4_RX_P: Interfaces (J2.13 R30.1), NetworkSwitch (U6.15)
ETH4_TX_N: Interfaces (J2.16 R33.1), NetworkSwitch (U6.13)
ETH4_TX_P: Interfaces (J2.15 R32.1), NetworkSwitch (U6.12)
ETH5_RX_N: Interfaces (J2.20 R35.1), NetworkSwitch (U6.5)
ETH5_RX_P: Interfaces (J2.19 R34.1), NetworkSwitch (U6.4)
ETH5_TX_N: Interfaces (J2.22 R37.1), NetworkSwitch (U6.2)
ETH5_TX_P: Interfaces (J2.21 R36.1), NetworkSwitch (U6.1)
ETH6_RX_N: Interfaces (J2.26 R39.1), NetworkSwitch (U6.116)
ETH6_RX_P: Interfaces (J2.25 R38.1), NetworkSwitch (U6.115)
ETH6_TX_N: Interfaces (J2.28 R41.1), NetworkSwitch (U6.113)
ETH6_TX_P: Interfaces (J2.27 R40.1), NetworkSwitch (U6.112)
NetC5_1: EthernetBridge (C5.1), ComputeModule (U1.116)
NetC6_1: EthernetBridge (C6.1), ComputeModule (U1.118)
NetC51_2: NetworkSwitch (C51.2 D9.1 R61.1 U6.95), EthernetBridge (U16.42)
NetD2_1: Interfaces (J1.10), CANbus (D2.1 R49.1 U4.6)
NetD2_2: Interfaces (J1.9), CANbus (D2.2 R47.2 U4.7)
NetJ1_13: Interfaces (J1.13), ComputeModule (U1.48)
NetJ1_14: Interfaces (J1.14 R2.2), ComputeModule (U1.50)
NetJ1_15: Interfaces (J1.15 R3.2), ComputeModule (U1.36)
NetJ1_16: Interfaces (J1.16 R4.2), ComputeModule (U1.46)
NetJ1_17: Interfaces (J1.17 R5.2), ComputeModule (U1.30)
NetJ1_18: Interfaces (J1.18 R6.2), ComputeModule (U1.34)
NetJ1_19: Interfaces (J1.19 R7.2), ComputeModule (U1.26)
NetJ1_20: Interfaces (J1.20 R8.2), ComputeModule (U1.28)
NetJ1_21: Interfaces (J1.21 R9.2), ComputeModule (U1.55)
NetJ1_22: Interfaces (J1.22 R10.2), ComputeModule (U1.24)
NetJ1_23: Interfaces (J1.23 R11.2), ComputeModule (U1.49)
NetJ1_24: Interfaces (J1.24 R12.2), ComputeModule (U1.51)
NetJ1_25: Interfaces (J1.25 R13.2), ComputeModule (U1.45)
NetJ1_26: Interfaces (J1.26 R14.2), ComputeModule (U1.47)
NetJ1_27: Interfaces (J1.27 R15.2), ComputeModule (U1.37)
NetJ1_28: Interfaces (J1.28 R16.2), ComputeModule (U1.41)
NetJ1_29: Interfaces (J1.29 R17.2), ComputeModule (U1.31)
NetJ1_30: Interfaces (J1.30 R18.2), ComputeModule (U1.35)
NetJ1_31: Interfaces (J1.31 R19.2), ComputeModule (U1.27)
NetJ1_32: Interfaces (J1.32 R20.2), ComputeModule (U1.29)
NetJ1_33: Interfaces (J1.33 R21.2), ComputeModule (U1.25)
NetJ3_1: Interfaces (J3.1), ComputeModule (U1.92)
NetR44_1: Interfaces (R44.1 R45.2 U2.2), ComputeModule (U1.101)
NetR48_2: CANbus (R48.2), ComputeModule (U1.54)
NetR57_1: NetworkSwitch (R57.1 U6.92), EthernetBridge (U16.41)
NetR62_2: NetworkSwitch (U6.70), EthernetBridge (R62.2)
NetR63_2: NetworkSwitch (U6.69), EthernetBridge (R63.2)
NetR64_2: NetworkSwitch (U6.68), EthernetBridge (R64.2)
NetR65_2: NetworkSwitch (U6.67), EthernetBridge (R65.2)
NetR69_1: NetworkSwitch (R69.1 R90.2), EthernetBridge (U16.15)
NetR70_1: NetworkSwitch (R70.1 R89.2), EthernetBridge (U16.16)
NetR71_1: NetworkSwitch (R71.1 R88.2), EthernetBridge (U16.17)
NetR72_1: NetworkSwitch (R72.1 R87.2), EthernetBridge (U16.18)
NetR73_1: NetworkSwitch (R73.1), EthernetBridge (U16.22)
NetR74_1: NetworkSwitch (R74.1), EthernetBridge (U16.23)
NetR75_1: NetworkSwitch (R75.1), EthernetBridge (U16.11)
NetR76_1: NetworkSwitch (R76.1), EthernetBridge (U16.10)
NetR77_1: NetworkSwitch (R77.1 R92.2), EthernetBridge (U16.20)
NetR78_1: NetworkSwitch (R78.1 R91.2), EthernetBridge (U16.14)
NetR79_1: NetworkSwitch (R79.1), EthernetBridge (U16.13)
NetR95_1: ComputeModule (U1.56), Power-Supplies (R95.1 U8.20)
NetR106_2: ComputeModule (U1.58), Power-Supplies (R106.2 R107.2)
NetR121_1: ComputeModule (R121.1 U1.82 U12.6), Sensors (U17.9), Power-Supplies (U7.7 U10.9)
NetR122_1: ComputeModule (R122.1 U1.80 U12.7), Sensors (U17.10), Power-Supplies (U7.6 U10.10)
NetR131_1: NetworkSwitch (U6.97), EthernetBridge (R131.1 U16.63)
NetR135_1: EthernetBridge (R135.1 U16.44), ComputeModule (U14.4)
NetU1_38: CANbus (U5.12), ComputeModule (U1.38)
NetU1_39: CANbus (U5.16), ComputeModule (U1.39)
NetU1_40: CANbus (U5.15), ComputeModule (U1.40)
NetU1_44: CANbus (U5.14), ComputeModule (U1.44)
NetU1_102: EthernetBridge (U16.66), ComputeModule (U1.102)
NetU1_103: Interfaces (U2.4), ComputeModule (U1.103)
NetU1_105: Interfaces (U2.3), ComputeModule (U1.105)
NetU1_109: EthernetBridge (U16.68), ComputeModule (U1.109)
NetU1_110: EthernetBridge (U16.36), ComputeModule (U1.110)
NetU1_112: EthernetBridge (U16.37), ComputeModule (U1.112)
NetU1_122: EthernetBridge (U16.27), ComputeModule (U1.122)
NetU1_124: EthernetBridge (U16.28), ComputeModule (U1.124)
NetU6_100: NetworkSwitch (U6.100), EthernetBridge (U16.64)
NetU6_126: NetworkSwitch (U6.126), EthernetBridge (U16.21)